# Altium schematic sheet ESP32_CAN_V2-mcu.SchDoc: ESP32_CAN_V2 - ESP unit
size A4; DrawnBy: Balazs Finaczy, Laszlo Goczan; SheetNumber: 2; SheetTotal: 6
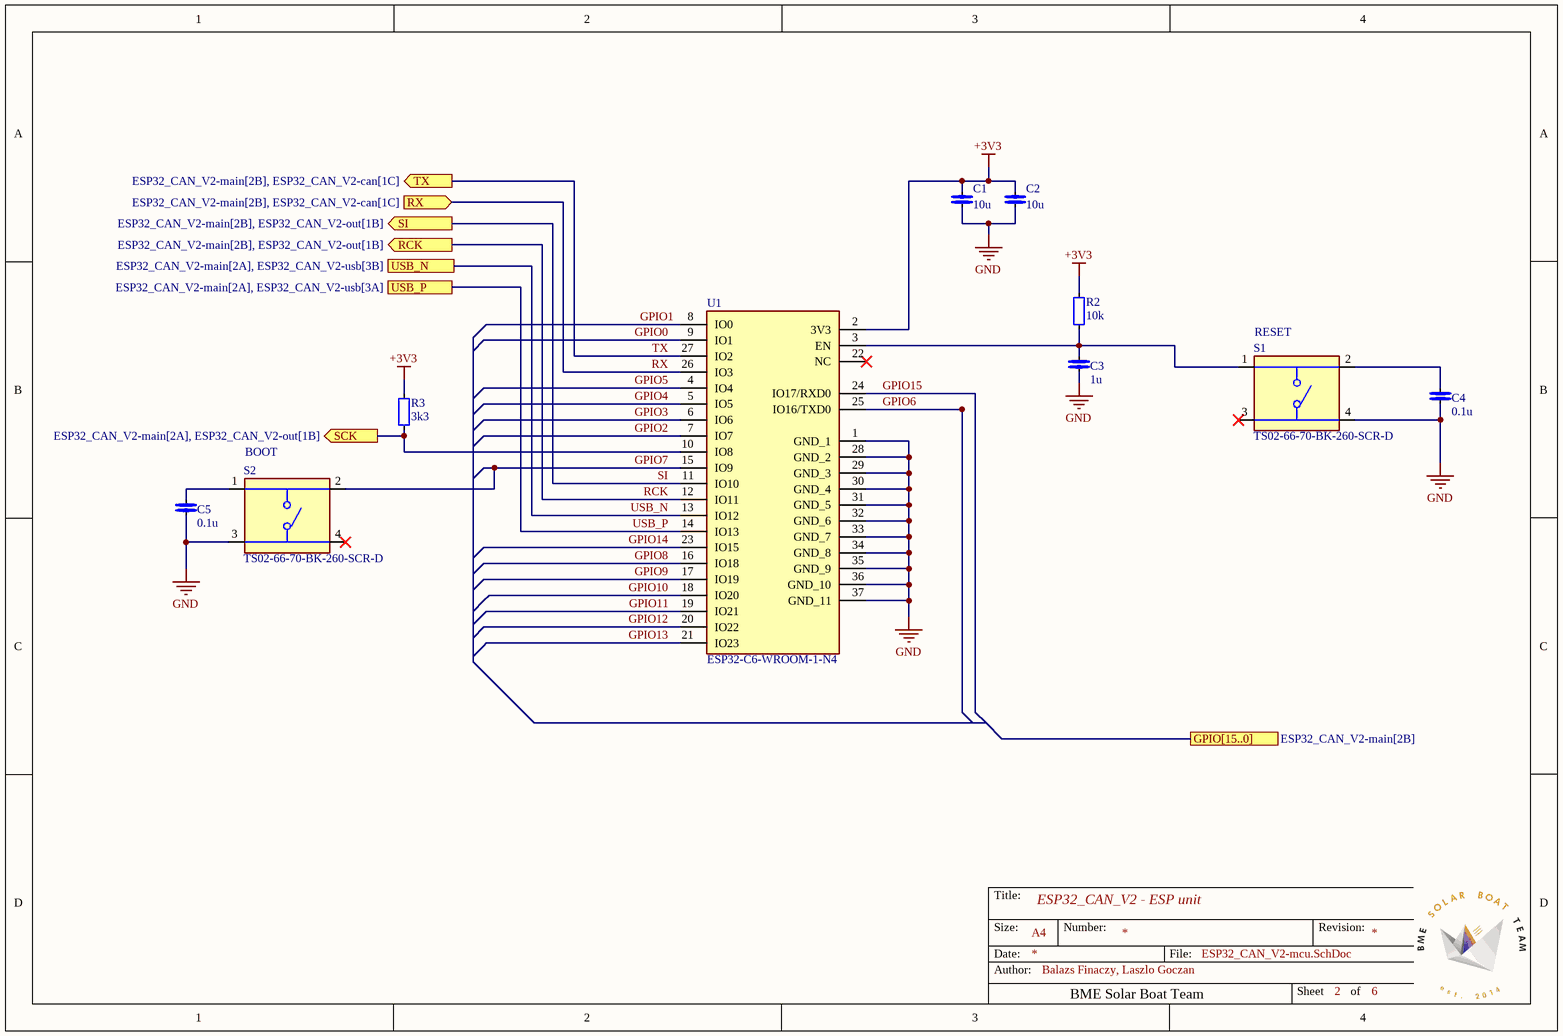
[diagram p0: ESP32_CAN_V2-mcu.SchDoc]

## Parts
C1  10u  [C0805]
C2  10u  [C0805]
C3  1u  [C0603]
C4  0.1u  [C0603]
C5  0.1u  [C0603]
R2  10k  [R0603]
R3  3k3  [R0603]
S1  TS02-66-70-BK-260-SCR-D  [SW_TS02-66-70-BK-260-SCR-D]
S2  TS02-66-70-BK-260-SCR-D  [SW_TS02-66-70-BK-260-SCR-D]
U1  ESP32-C6-WROOM-1-N4  [ESP32C6WROOM1N4]

## Ports
GPIO[15..0] (see ESP32_CAN_V2-main[2B]), RCK (out, see ESP32_CAN_V2-main[2B], ESP32_CAN_V2-out[1B]), RX (in, see ESP32_CAN_V2-main[2B], ESP32_CAN_V2-can[1C]), SCK (out, see ESP32_CAN_V2-main[2A], ESP32_CAN_V2-out[1B]), SI (out, see ESP32_CAN_V2-main[2B], ESP32_CAN_V2-out[1B]), TX (out, see ESP32_CAN_V2-main[2B], ESP32_CAN_V2-can[1C]), USB_N (see ESP32_CAN_V2-main[2A], ESP32_CAN_V2-usb[3B]), USB_P (see ESP32_CAN_V2-main[2A], ESP32_CAN_V2-usb[3A])

## Nets
+3V3: C1.2 C2.2 R2.2 R3.2 U1.2(3V3)
GND: C1.1 C2.1 C3.1 C4.1 C5.1 S1.4 S2.3 U1.1(GND_1) U1.28(GND_2) U1.29(GND_3) U1.30(GND_4) U1.31(GND_5) U1.32(GND_6) U1.33(GND_7) U1.34(GND_8) U1.35(GND_9) U1.36(GND_10) U1.37(GND_11)
GPIO0: U1.9(IO1)
GPIO1: U1.8(IO0)
GPIO2: U1.7(IO7)
GPIO3: U1.6(IO6)
GPIO4: U1.5(IO5)
GPIO5: U1.4(IO4)
GPIO6: U1.25(IO16/TXD0)
GPIO7: S2.2 U1.15(IO9)
GPIO8: U1.16(IO18)
GPIO9: U1.17(IO19)
GPIO10: U1.18(IO20)
GPIO11: U1.19(IO21)
GPIO12: U1.20(IO22)
GPIO13: U1.21(IO23)
GPIO14: U1.23(IO15)
GPIO15: U1.24(IO17/RXD0)
RCK: U1.12(IO11) ; port RCK
RX: U1.26(IO3) ; port RX
SCK: R3.1 U1.10(IO8) ; port SCK
SI: U1.11(IO10) ; port SI
TX: U1.27(IO2) ; port TX
USB_N: U1.13(IO12) ; port USB_N
USB_P: U1.14(IO13) ; port USB_P
NetC3_2: C3.2 R2.1 S1.1 U1.3(EN)
NetC4_2: C4.2 S1.2
NetC5_2: C5.2 S2.1

Not connected (* = marked no-connect by the designer): S1 3*; S2 4*; U1 22(NC)*

## Notes on the sheet
- (near S1) RESET
- (near S2) BOOT
- Title:
- Size:
- Date:
- Author:
- A4
- Number:
- BME Solar Boat Team
- File:
- Revision:
- Sheet
- of

## Library data of the parts
C1-C5 = C
R2 R3 = R
S1 S2 = TS02-66-70-BK-260-SCR-D: 6 x 6 mm, 7 mm Actuator Height, 260 gf, Black, Short Crimped, Through Hole, SPST, Tactile Switch; MF: Same Sky; SnapEDA_Link: https://www.snapeda.com/parts/TS02-66-70-BK-260-SCR-D/Same+Sky/view-part/?ref=snap; Package: None; Value: *; MP: TS02-66-70-BK-260-SCR-D; Check_prices: https://www.snapeda.com/parts/TS02-66-70-BK-260-SCR-D/Same+Sky/view-part/?ref=eda
U1 = ESP32-C6-WROOM-1-N4_reorder: 802.15.4, Bluetooth, WiFi Bluetooth v5.0, Zigbee Transceiver Module 2.4GHz PCB Trace Surface Mount; Manufacturer_Name: Espressif Systems; Geometry.Height: 3.25mm; Mouser Part Number: 356-ESP32C6WROOM1N4; Mouser Price/Stock: https://www.mouser.co.uk/ProductDetail/Espressif-Systems/ESP32-C6-WROOM-1-N4?qs=8Wlm6%252BaMh8R1JRAtXlt87w%3D%3D; Manufacturer_Part_Number: ESP32-C6-WROOM-1-N4; Datasheet Link: https://www.espressif.com/sites/default/files/documentation/esp32-c6-wroom-1_wroom-1u_datasheet_en.pdf